# Altium project converter.PrjPcb (part 3 of 3)

## Sheet [04] - POWER SUPPLY.SchDoc
size A4; DocumentNumber: 3; SheetNumber: 3; SheetTotal: 6
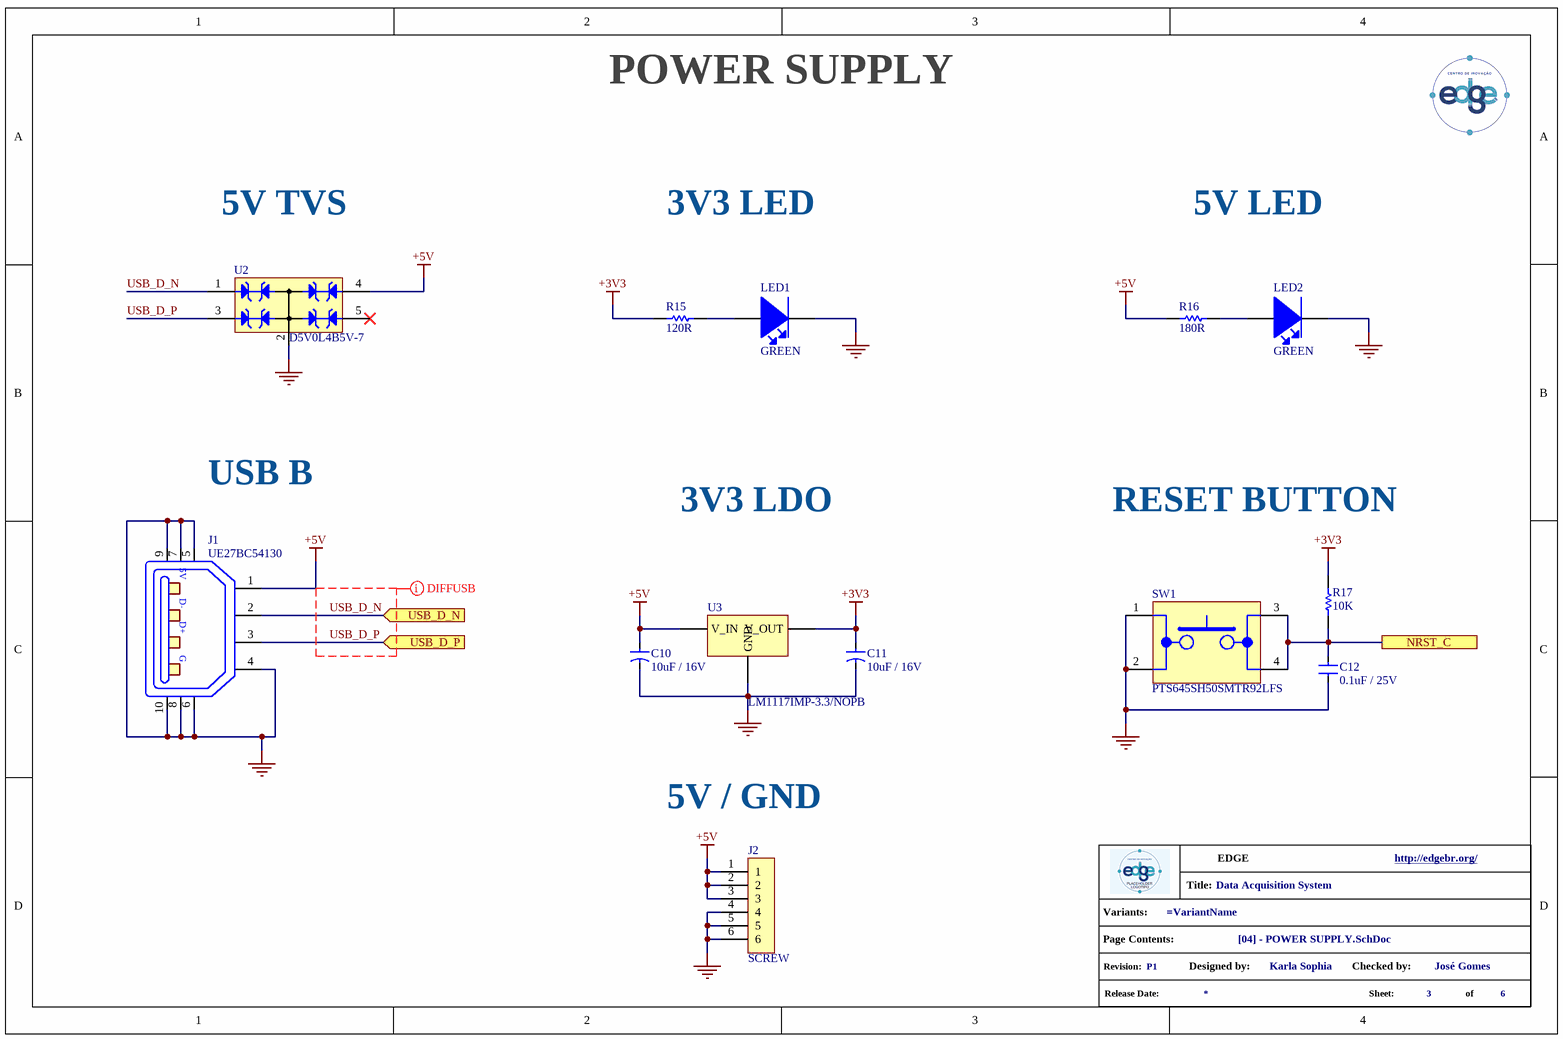
[diagram p5: [04] - POWER SUPPLY.SchDoc]

### Parts
(Parts that share a designator on the sheet are numbered #1, #2 ... from top to bottom, then left to right.)
*?#6  info_project  (value not drawn)  (graphical)
C10  10uF / 16V  [CT0805]
C11  10uF / 16V  [CT0805]
C12  0.1uF / 25V  [C0805]
J1  UE27BC54130  [UE27BC54130]
J2  SCREW  [SCREW-6P]
LED1  GREEN  [LED_0805]
LED2  GREEN  [LED_0805]
R15  120R  [R0805]
R16  180R  [R0805]
R17  10K  [R0805]
SW1  PTS645SH50SMTR92LFS  [PTS645SH50SMTR92-LFS]
U2  D5V0L4B5V-7  [D5V0L4B5V-7]
U3  LM1117IMP-3.3/NOPB  [LM1117]

### Ports
NRST_C, USB_D_N (in), USB_D_P (in)

### Nets
+3V3: C11.1 R15.1 R17.2 U3.2(V_OUT)
+5V: C10.1 J1.1 J2.1 J2.2 J2.3 R16.1 U2.4 U3.1(V_IN)
GND: C10.2 C11.2 C12.1 J1.4 J1.5 J1.6 J1.7 J1.8 J1.9 J1.10 J2.4 J2.5 J2.6 LED1.1(Cathode) LED2.1(Cathode) SW1.1 SW1.2 U2.2 U3.3(GND)
NRST_C: C12.2 R17.1 SW1.3 SW1.4 ; port NRST_C
USB_D_N: J1.2 U2.1 ; port USB_D_N
USB_D_P: J1.3 U2.3 ; port USB_D_P
NetLED1_2: LED1.2(Anode) R15.2
NetLED2_2: LED2.2(Anode) R16.2

Not connected (* = marked no-connect by the designer): U2 5*

### Layout directives
differential pair; net class USB; differential pair class USB_D_LINES: USB_D_N, USB_D_P

### Notes on the sheet
- POWER SUPPLY
- 5V TVS
- 3V3 LED
- 5V LED
- USB B
- 3V3 LDO
- RESET BUTTON
- 5V / GND
- (in symbol info_project) Title:; Variants:; Page Contents:; Revision:; Designed by:; Checked by:; Release Date:; Sheet:; of
- (in symbol UE27BC54130) 5V; D-; D+; G

### Library data of the parts
C10 C11 = TCTP1C106M8R: TAL CAP - 10UF 16V 0805 +/- 20%; Manufacturer: Rohm; ESR (Equivalent Series Resistance): 6R; Supplier 1: Digi-Key; Manufacturer Part Number: TCTP1C106M8R; RoHS: Yes; Category: Tantalum Capacitors; Stock 1: 134422; Pricing 1: 1=0,86000, 10=0,63300, 50=0,50640, 100=0,43400, 500=0,34360, 1000=0,28934 (USD); Mount: Surface Mount; Case/Package: 0805; Case Code (Metric): 2012; Case Code (Imperial): 0805; Min Operating Temperature: -55°C; Max Operating Temperature: 125°C; Package Quantity: 3000; Capacitance: 10uF; Voltage Rating: 16V; Tolerance: 20%; Packaging: Tape and Reel; Voltage: 16V; Features: General Purpose; Series: TCT; Length: 0.079inch; Width: 0.049inch; Height - Seated (Max): 0.047inch; Lead Free: Lead Free; RoHS Compliant: Yes; ComponentLink1URL: https://datasheet.ciiva.com/259/tct-p-259243.pdf?src-supplier=Digi-Key; ComponentLink1Description: https://datasheet.ciiva.com/259/tct-p-259243.pdf?src-supplier=Digi-Key; ComponentLink2URL: https://datasheet.ciiva.com/259/tct-p-259244.pdf?src-supplier=Digi-Key; ComponentLink2Description: https://datasheet.ciiva.com/259/tct-p-259244.pdf?src-supplier=Digi-Key; ComponentLink3URL: https://datasheet.ciiva.com/259/tct-p-259245.pdf?src-supplier=Digi-Key; ComponentLink3Description: https://datasheet.ciiva.com/259/tct-p-259245.pdf?src-supplier=Digi-Key; Supplier Part Number 1: 511-1683-1-ND
C12 = CC0805KRX7R8BB104: MLCC - 0.1uF 25V 0805 X7R +/- 10%; Manufacturer: Yageo; Material: Ceramic; Capacitance: 100nF; Insulation Resistance: 100GR; Supplier 1: Digi-Key; Manufacturer Part Number: CC0805KRX7R8BB104; RoHS: Yes; Category: Ceramic Capacitors; Stock 1: 331734; Pricing 1: 1=0,12000, 10=0,08800, 50=0,04980, 100=0,04130, 500=0,02894, 1000=0,02396 (USD); Mount: Surface Mount; Case/Package: 0805; Number of Pins: 2; Case Code (Metric): 2012; Case Code (Imperial): 0805; Min Operating Temperature: -55°C; Max Operating Temperature: 125°C; Tolerance: 10%; Dielectric: X7R; Series: CC; Package Quantity: 1; Voltage Rating: 25V; Packaging: Tape and Reel; Voltage Rating (DC): 25V; Termination: SMD/SMT; Resistor Type: Ceramic; Length: 2mm; Width: 0.049inch; Height: 0.85mm; Depth: 1.25mm; Thickness: 0.033inch; Radiation Hardening: No; RoHS Compliant: Yes; REACH SVHC: No SVHC; Lead Free: Lead Free; Halogen Free: Halogen Free; ComponentLink1URL: https://datasheet.ciiva.com/145/mlccorderingcode-145007.pdf?src-supplier=Digi-Key; ComponentLink1Description: https://datasheet.ciiva.com/145/mlccorderingcode-145007.pdf?src-supplier=Digi-Key; ComponentLink2URL: https://datasheet.ciiva.com/145/mlccorderingcode-145008.pdf?src-supplier=Digi-Key; ComponentLink2Description: https://datasheet.ciiva.com/145/mlccorderingcode-145008.pdf?src-supplier=Digi-Key; ComponentLink3URL: https://datasheet.ciiva.com/145/mlccorderingcode-145009.pdf?src-supplier=Digi-Key; ComponentLink3Description: https://datasheet.ciiva.com/145/mlccorderingcode-145009.pdf?src-supplier=Digi-Key; ComponentLink4URL: https://datasheet.ciiva.com/8034/1784427-8034029.pdf?src-supplier=Element14; ComponentLink4Description: https://datasheet.ciiva.com/8034/1784427-8034029.pdf?src-supplier=Element14; ComponentLink5URL: https://datasheet.ciiva.com/8034/1784427-8034030.pdf?src-supplier=Element14; ComponentLink5Description: https://datasheet.ciiva.com/8034/1784427-8034030.pdf?src-supplier=Element14; ComponentLink6URL: https://datasheet.ciiva.com/8034/70765-8034031.pdf?src-supplier=Element14; ComponentLink6Description: https://datasheet.ciiva.com/8034/70765-8034031.pdf?src-supplier=Element14; ComponentLink7URL: https://datasheet.ciiva.com/46430/1850775-46430166.pdf?src-supplier=Element14; ComponentLink7Description: https://datasheet.ciiva.com/46430/1850775-46430166.pdf?src-supplier=Element14; ComponentLink8URL: https://datasheet.ciiva.com/28450/1489800-28450789.pdf?src-supplier=Element14; ComponentLink8Description: https://datasheet.ciiva.com/28450/1489800-28450789.pdf?src-supplier=Element14; ComponentLink9URL: https://datasheet.ciiva.com/15189/getdatasheetpartid-330244-15189223.pdf?src-supplier=Verical; ComponentLink9Description: https://datasheet.ciiva.com/15189/getdatasheetpartid-330244-15189223.pdf?src-supplier=Verical; ComponentLink10URL: https://datasheet.ciiva.com/16625/upy-gphc-x7r-6-3v-to-50v-8-16625546.pdf?src-supplier=Avnet+Europe; ComponentLink10Description: https://datasheet.ciiva.com/16625/upy-gphc-x7r-6-3v-to-50v-8-16625546.pdf?src-supplier=Avnet+Europe; Supplier Part Number 1: 311-1141-1-ND
J1 = UE27BC54130: CONN USB RECPT B 2.0; Manufacturer: Amphenol Commercial; Number of Terminals/Pins: 4; Gender: Receptacle; Number of Ports: 1; Insulation Resistance: 1GR; Pitch: 2.5mm; Supplier 1: Digi-Key; Manufacturer Part Number: UE27BC54130; RoHS: Yes; Category: RF / Coaxial Connectors; Stock 1: 8145; Pricing 1: 1=1,15000, 10=1,01500, 25=0,95560, 40=0,91575, 120=0,87592, 240=0,79633, 480=0,71669, 960=0,63705, 2400=0,57733 (USD); Mount: Through Hole,Horizontal; Contact Plating: Gold; Color: Black; Contact Material: Bronze; Housing Material: Polybutylene; Termination: Solder; Packaging: Bulk; Connector Type: USB; Number of Contacts: 4; Orientation: Right Angle; Package Quantity: 3000; Series: UE27; Length: 12.04mm; Depth: 16.3mm; Radiation Hardening: No; ComponentLink1URL: https://datasheet.ciiva.com/851/ue27bcx4xxx-851809.pdf?src-supplier=Digi-Key; ComponentLink1Description: https://datasheet.ciiva.com/851/ue27bcx4xxx-851809.pdf?src-supplier=Digi-Key; ComponentLink2URL: https://datasheet.ciiva.com/10945/ue27bcx4xxx-10945210.pdf?src-supplier=Avnet; ComponentLink2Description: https://datasheet.ciiva.com/10945/ue27bcx4xxx-10945210.pdf?src-supplier=Avnet; ComponentLink3URL: https://datasheet.ciiva.com/16668/ue27bcx4xxx-16668218.pdf?src-supplier=Avnet+Europe; ComponentLink3Description: https://datasheet.ciiva.com/16668/ue27bcx4xxx-16668218.pdf?src-supplier=Avnet+Europe; Supplier Part Number 1: UE27BC54130-ND
J2 = 282834-6: TERM BLK 6P SIDE 2.54MM; Manufacturer: TE Connectivity; Plating: Brass,Steel; Number of Contacts: 6; Current Rating: 10A; Voltage Rating: 150V; Number of Levels: 1; Connector Type: Receptacle; Closed End: No (Without); Screwless Terminal Block: Yes (With); Gender: Female; Wire Gauge (Max): 30AWG; Wire Gauge (Min): 16AWG; Thread Size: M1.6; Tail Length: 3.4mm; Approvals: UL; Supplier 1: Digi-Key; Manufacturer Part Number: 282834-6; RoHS: Yes; Category: Terminal Blocks; Stock 1: 7269; Pricing 1: 1=5,33000, 10=4,06500, 25=3,80720, 50=3,38400, 100=3,31050, 250=3,05300, 500=2,75874, 1000=2,45221 (USD); Mount: Through Hole; Color: Green; Contact Plating: Tin; Contact Material: Brass; Housing Color: Green; Housing Material: Polyamide; Material: Nylon; Min Operating Temperature: -40°C; Max Operating Temperature: 105°C; Termination: Solder; Orientation: Straight; Package Quantity: 100; Packaging: Box; Number of Rows: 1; Series: Buchanan; Number of Positions Per Level: 6; Current: 10A; Voltage: 150V; Number of Positions: 6; Number of Circuits: 6; Max Current Rating: 10A; Interlock: No (Without); Screw Flange: No (Without); Side Stackable: Yes (With); Max Supply Voltage (AC): 150V; Number of Poles: 6; Max Voltage Rating (AC): 150V; Length: 15.7mm; Width: 6.5mm; Pitch: 2.54mm; Depth: 6.5mm; Wire/Cable Gauge: 30AWG; Radiation Hardening: No; Flammability Rating: UL94 V-0; ELV: Compliant; REACH SVHC: Unknown; Lead Free: Lead Free; ComponentLink1URL: https://datasheet.ciiva.com/823/eng-cd-282834-c1-823488.pdf?src-supplier=Digi-Key; ComponentLink1Description: https://datasheet.ciiva.com/823/eng-cd-282834-c1-823488.pdf?src-supplier=Digi-Key; ComponentLink2URL: https://datasheet.ciiva.com/16308/282834-6-16308413.pdf?src-supplier=Future+Electronics; ComponentLink2Description: https://datasheet.ciiva.com/16308/282834-6-16308413.pdf?src-supplier=Future+Electronics; ComponentLink3URL: https://datasheet.ciiva.com/25618/0900766b810c7187-25618156.pdf?src-supplier=RSComponents; ComponentLink3Description: https://datasheet.ciiva.com/25618/0900766b810c7187-25618156.pdf?src-supplier=RSComponents; ComponentLink4URL: https://datasheet.ciiva.com/9370/eng-cs-1308389-eurostyle-terminal-blocks-0607-9370422.pdf?src-supplier=Avnet; ComponentLink4Description: https://datasheet.ciiva.com/9370/eng-cs-1308389-eurostyle-terminal-blocks-0607-9370422.pdf?src-supplier=Avnet; ComponentLink5URL: https://datasheet.ciiva.com/16676/eng-cs-1308389-eurostyle-terminal-blocks-0607-16676062.pdf?src-supplier=Avnet+Europe; ComponentLink5Description: https://datasheet.ciiva.com/16676/eng-cs-1308389-eurostyle-terminal-blocks-0607-16676062.pdf?src-supplier=Avnet+Europe; ComponentLink6URL: https://datasheet.ciiva.com/30097/eng-cs-1308389-eurostyle-terminal-blocks-0607-30097352.pdf?src-supplier=Onlinecomponents.com; ComponentLink6Description: https://datasheet.ciiva.com/30097/eng-cs-1308389-eurostyle-terminal-blocks-0607-30097352.pdf?src-supplier=Onlinecomponents.com; Supplier Part Number 1: A98337-ND
LED1 = 7012X5: SMD LED GREEN 2.1V 0805 20mA; Manufacturer: VCC CHML; Lens Color: Clear; Lens Style: Diffused,Rectangular; Luminous Intensity: 6.4mcd; Viewing Angle: 120°; Wavelength: 560nm; Power Rating: 62.5mW; Number of Elements: 1; Reverse Voltage (DC): 4V; Supplier 1: Digi-Key; Manufacturer Part Number: 7012X5; RoHS: Yes; Category: LEDs; Stock 1: 153089; Pricing 1: 1=0,60000, 10=0,39600, 100=0,26210, 1000=0,20235, 2000=0,18285 (USD); Mount: Surface Mount; Case/Package: 0805; Number of Pins: 2; Color: Green; Case Code (Metric): 2012; Case Code (Imperial): 0805; Min Operating Temperature: -40°C; Max Operating Temperature: 85°C; Packaging: Tape and Reel; Forward Voltage: 2.1V; Package Quantity: 1; Illumination Color: Green; Forward Current: 20mA; Test Current: 20mA; Power Dissipation: 62.5mW; Reverse Voltage: 4V; Series: BrightChips™; Number of LEDs: 1; Length: 2mm; Width: 1.25mm; Height: 1mm; Depth: 1.25mm; Lead Free: Lead Free; RoHS Compliant: Yes; REACH SVHC: Unknown; ComponentLink1URL: https://datasheet.ciiva.com/2114/1-26-2114592.pdf?src-supplier=Digi-Key; ComponentLink1Description: https://datasheet.ciiva.com/2114/1-26-2114592.pdf?src-supplier=Digi-Key; ComponentLink2URL: https://datasheet.ciiva.com/7639/726505-7639302.pdf?src-supplier=Element14; ComponentLink2Description: https://datasheet.ciiva.com/7639/726505-7639302.pdf?src-supplier=Element14; ComponentLink3URL: https://datasheet.ciiva.com/46391/726505-46391115.pdf?src-supplier=Element14; ComponentLink3Description: https://datasheet.ciiva.com/46391/726505-46391115.pdf?src-supplier=Element14; ComponentLink4URL: https://datasheet.ciiva.com/16214/7012xseriesbrightchipshighbrightnesssmtleds0805packagesize-16214285.pdf?src-supplier=Future+Electronics; ComponentLink4Description: https://datasheet.ciiva.com/16214/7012xseriesbrightchipshighbrightnesssmtleds0805packagesize-16214285.pdf?src-supplier=Future+Electronics; Supplier Part Number 1: L61105CT-ND
LED2 = 150080GS75000: SMD LED GREEN 3.2V 0805 20mA; Manufacturer: Wurth Electronics; Viewing Angle: 140°; Lens Style: Clear,Rectangular; Luminous Intensity: 450mcd; Wavelength: 520nm; Forward Current: 30mA; Supplier 1: Digi-Key; Manufacturer Part Number: 150080GS75000; RoHS: Yes; Category: LEDs; Stock 1: 102669; Pricing 1: 1=0,18000, 50=0,16500, 100=0,14200, 500=0,12300 (USD); Mount: Surface Mount; Case/Package: 0805; Color: Green; Case Code (Metric): 2012; Case Code (Imperial): 0805; Min Operating Temperature: -40°C; Max Operating Temperature: 85°C; Package Quantity: 4000; Forward Voltage: 3.2V; Packaging: Cut Tape; Dominant Wavelength: 520nm; Test Current: 20mA; Length: 2mm; Width: 1.25mm; Height: 0.7mm; REACH SVHC: Unknown; RoHS Compliant: Yes; ComponentLink1URL: https://datasheet.ciiva.com/29563/150080gs75000-29563008.pdf?src-supplier=Digi-Key; ComponentLink1Description: https://datasheet.ciiva.com/29563/150080gs75000-29563008.pdf?src-supplier=Digi-Key; ComponentLink2URL: https://datasheet.ciiva.com/29279/759434-da-01-en-chipled-0805-w-kl-gruen-150080gs75000-29279039.pdf?src-supplier=Conrad; ComponentLink2Description: https://datasheet.ciiva.com/29279/759434-da-01-en-chipled-0805-w-kl-gruen-150080gs75000-29279039.pdf?src-supplier=Conrad; Supplier Part Number 1: 732-4983-1-ND
R15 = RMCF0805JT120R: RES - 120R 1/8W 0805 5%; Manufacturer: Stackpole Electronics; Max Power Dissipation: 125mW; Temperature Coefficient: 200ppm/°C; Supplier 1: Digi-Key; Manufacturer Part Number: RMCF0805JT120R; RoHS: Yes; Category: Chip SMD Resistors; Stock 1: 223393; Pricing 1: 1=0.10000, 10=0.02000, 100=0.00810, 1000=0.00366, 2500=0.00318 (USD); Mount: Surface Mount; Case/Package: 0805; Case Code (Metric): 2012; Case Code (Imperial): 0805; Contact Plating: Tin,Matte; Min Operating Temperature: -55°C; Max Operating Temperature: 155°C; Packaging: Tape and Reel; Resistance: 120R; Tolerance: 5%; Resistor Type: Thick Film; Number of Terminations: 2; Features: Automotive AEC-Q200; Series: RMCF; Construction: Rectangular; Length: 0.079inch; Width: 0.049inch; Height: 0.026inch; Depth: 1.25mm; Radiation Hardening: No; Military Standard: Not; Lead Free: Lead Free; RoHS Compliant: Yes; ComponentLink1URL: https://datasheet.ciiva.com/15193/getdatasheetpartid-409758-15193629.pdf?src-supplier=Verical; ComponentLink1Description: https://datasheet.ciiva.com/15193/getdatasheetpartid-409758-15193629.pdf?src-supplier=Verical; Supplier Part Number 1: RMCF0805JT120RCT-ND
R16 = ERJ-6GEYJ181V: RES - 180R 1/8W 0805 5%; Manufacturer: Panasonic; Temperature Coefficient: 200ppm/°C; Voltage Rating: 150V; Power Rating: 125mW; Supplier 1: Digi-Key; Manufacturer Part Number: ERJ-6GEYJ181V; RoHS: Yes; Category: Chip SMD Resistors; Stock 1: 83932; Pricing 1: 1=0,10000, 10=0,06800, 100=0,02780, 1000=0,01246, 2500=0,01082 (USD); Mount: Surface Mount; Case/Package: 0805; Contact Plating: Tin; Case Code (Metric): 2012; Case Code (Imperial): 0805; Weight: 0.000194oz; Min Operating Temperature: -55°C; Max Operating Temperature: 155°C; Tolerance: 5%; Resistance: 180R; Resistor Type: Thick Film; Packaging: Tape and Reel; Package Quantity: 1; Number of Terminations: 2; Termination: SMD/SMT; Max Power Dissipation: 125mW; Voltage Rating (DC): 150V; Features: Automotive AEC-Q200; Series: ERJ; Construction: Rectangular; Resistance Tolerance: 5%; Technology: THICK FILM; Length: 2mm; Width: 0.049inch; Height: 0.6mm; Depth: 1.25mm; Radiation Hardening: No; REACH SVHC: No SVHC; Military Standard: Not; Lead Free: Lead Free; RoHS Compliant: Yes; ComponentLink1URL: https://datasheet.ciiva.com/11821/0900766b80f806dd-11821549.pdf?src-supplier=RSComponents; ComponentLink1Description: https://datasheet.ciiva.com/11821/0900766b80f806dd-11821549.pdf?src-supplier=RSComponents; ComponentLink2URL: https://datasheet.ciiva.com/46386/1500035-46386364.pdf?src-supplier=Element14; ComponentLink2Description: https://datasheet.ciiva.com/46386/1500035-46386364.pdf?src-supplier=Element14; ComponentLink3URL: https://datasheet.ciiva.com/5860/1500035-5860701.pdf?src-supplier=Farnell; ComponentLink3Description: https://datasheet.ciiva.com/5860/1500035-5860701.pdf?src-supplier=Farnell; ComponentLink4URL: https://datasheet.ciiva.com/46373/1500035-46373964.pdf?src-supplier=Element14; ComponentLink4Description: https://datasheet.ciiva.com/46373/1500035-46373964.pdf?src-supplier=Element14; ComponentLink5URL: https://datasheet.ciiva.com/28546/1678796-28546149.pdf?src-supplier=Element14; ComponentLink5Description: https://datasheet.ciiva.com/28546/1678796-28546149.pdf?src-supplier=Element14; ComponentLink6URL: https://datasheet.ciiva.com/24124/aoa0000ce1-37422-24124213.pdf?src-supplier=Mouser; ComponentLink6Description: https://datasheet.ciiva.com/24124/aoa0000ce1-37422-24124213.pdf?src-supplier=Mouser; ComponentLink7URL: https://datasheet.ciiva.com/16787/70255313-16787531.pdf?src-supplier=Allied+Electronics; ComponentLink7Description: https://datasheet.ciiva.com/16787/70255313-16787531.pdf?src-supplier=Allied+Electronics; ComponentLink8URL: https://datasheet.ciiva.com/16782/70255313-16782252.pdf?src-supplier=Allied+Electronics; ComponentLink8Description: https://datasheet.ciiva.com/16782/70255313-16782252.pdf?src-supplier=Allied+Electronics; ComponentLink9URL: https://datasheet.ciiva.com/9184/aoa0000ce1-9184891.pdf?src-supplier=Avnet; ComponentLink9Description: https://datasheet.ciiva.com/9184/aoa0000ce1-9184891.pdf?src-supplier=Avnet; ComponentLink10URL: https://datasheet.ciiva.com/30073/4aoa0000ce1-30073221.pdf?src-supplier=Onlinecomponents.com; ComponentLink10Description: https://datasheet.ciiva.com/30073/4aoa0000ce1-30073221.pdf?src-supplier=Onlinecomponents.com; ComponentLink11URL: https://datasheet.ciiva.com/17207/aoa0000ce1-17207135.pdf?src-supplier=Avnet+Europe; ComponentLink11Description: https://datasheet.ciiva.com/17207/aoa0000ce1-17207135.pdf?src-supplier=Avnet+Europe; Supplier Part Number 1: P180ACT-ND
R17 = RC0805FR-0710KL: RES - 10K  1/8W 0805 1%; Manufacturer: Yageo; Resistance: 10kR; Temperature Coefficient: 100ppm/°C; Power Rating: 125mW; Voltage Rating: 150V; Supplier 1: Digi-Key; Manufacturer Part Number: RC0805FR-0710KL; RoHS: Yes; Category: Chip SMD Resistors; Stock 1: 5866675; Pricing 1: 1=0,10000, 10=0,04200, 100=0,01690, 1000=0,00759, 2500=0,00659 (USD); Case/Package: 0805; Case Code (Imperial): 0805; Case Code (Metric): 2012; Size Code: 0805; Min Operating Temperature: -55°C; Max Operating Temperature: 155°C; Tolerance: 1%; Resistor Type: Thick Film; Packaging: Tape and Reel; Package Quantity: 1; Termination: SMD/SMT; Number of Terminations: 2; Max Power Dissipation: 125mW; Features: Moisture Resistant; Series: RC; Construction: Rectangular; Resistance Tolerance: 1%; Technology: THICK FILM; Length: 2mm; Width: 0.049inch; Height: 0.024inch; Depth: 1.25mm; REACH SVHC: Unknown; Military Standard: Not; Lead Free: Lead Free; RoHS Compliant: Yes; ComponentLink1URL: https://datasheet.ciiva.com/11808/0900766b8106beab-11808151.pdf?src-supplier=RSComponents; ComponentLink1Description: https://datasheet.ciiva.com/11808/0900766b8106beab-11808151.pdf?src-supplier=RSComponents; ComponentLink2URL: https://datasheet.ciiva.com/12669/rc0805-12669688.pdf?src-supplier=Mouser; ComponentLink2Description: https://datasheet.ciiva.com/12669/rc0805-12669688.pdf?src-supplier=Mouser; ComponentLink3URL: https://datasheet.ciiva.com/2456/pyu-r-int-thick-7-2456974.pdf?src-supplier=Digi-Key; ComponentLink3Description: https://datasheet.ciiva.com/2456/pyu-r-int-thick-7-2456974.pdf?src-supplier=Digi-Key; ComponentLink4URL: https://datasheet.ciiva.com/2456/pyu-r-int-thick-7-2456972.pdf?src-supplier=Digi-Key; ComponentLink4Description: https://datasheet.ciiva.com/2456/pyu-r-int-thick-7-2456972.pdf?src-supplier=Digi-Key; ComponentLink5URL: https://datasheet.ciiva.com/2456/pyu-r-int-thick-7-2456973.pdf?src-supplier=Digi-Key; ComponentLink5Description: https://datasheet.ciiva.com/2456/pyu-r-int-thick-7-2456973.pdf?src-supplier=Digi-Key; ComponentLink6URL: https://datasheet.ciiva.com/16747/rc0805-16747087.pdf?src-supplier=Future+Electronics; ComponentLink6Description: https://datasheet.ciiva.com/16747/rc0805-16747087.pdf?src-supplier=Future+Electronics; ComponentLink7URL: https://datasheet.ciiva.com/46447/444164-46447563.pdf?src-supplier=Element14; ComponentLink7Description: https://datasheet.ciiva.com/46447/444164-46447563.pdf?src-supplier=Element14; Supplier Part Number 1: 311-10.0KCRCT-ND
SW1 = PTS645SH50SMTR92LFS: SWITCH TACTILE 0.05A 12V; Manufacturer: ITT C&K; Mechanical Life: 100000Cycles; Actuator Material: Nylon,Polyamide,PA66; Operating Force: 200gf; Throw Configuration: SPST; Current Rating: 50mA; Illumination Type: Non-Illuminated,Illuminated; Switch Function: Off-Mom; Actuator Type: Standard; Supplier 1: Digi-Key; Manufacturer Part Number: PTS645SH50SMTR92LFS; RoHS: Yes; Category: Tactile Switches; Stock 1: 211938; Pricing 1: 1=0,25000, 10=0,24200, 25=0,22960, 100=0,20780, 250=0,18944, 500=0,17610 (USD); Mount: Surface Mount; Case/Package: SMD/SMT; Contact Plating: Silver; Contact Material: Bronze; Color: Black; Min Operating Temperature: -20°C; Max Operating Temperature: 60°C; Packaging: Tape and Reel; Max Voltage Rating (DC): 12V; Termination: Gull Wing; Voltage Rating (DC): 12V; Package Quantity: 1000; Max Current Rating: 50mA; Orientation: Straight; Series: PTS645; Length: 6mm; Depth: 9mm; Lead Free: Lead Free; REACH SVHC: No SVHC; ComponentLink1URL: https://datasheet.ciiva.com/29903/getdatasheetpartid-773702-29903807.pdf?src-supplier=Verical; ComponentLink1Description: https://datasheet.ciiva.com/29903/getdatasheetpartid-773702-29903807.pdf?src-supplier=Verical; ComponentLink2URL: https://datasheet.ciiva.com/14920/pts645-14920741.pdf?src-supplier=Digi-Key; ComponentLink2Description: https://datasheet.ciiva.com/14920/pts645-14920741.pdf?src-supplier=Digi-Key; ComponentLink3URL: https://datasheet.ciiva.com/22637/1707731-22637356.pdf?src-supplier=Element14; ComponentLink3Description: https://datasheet.ciiva.com/22637/1707731-22637356.pdf?src-supplier=Element14; Supplier Part Number 1: CKN9085CT-ND
U2 = D5V0L4B5V-7: ESD TVS VRWM - 5V / VBR - 6-8V /; Manufacturer: Diodes; Direction: Bidirectional; Capacitance: 20pF; Max Surge Current: 6A; Number of Bidirectional Channels: 4; Min Breakdown Voltage: 6V; Clamping Voltage: 14V; Peak Pulse Power: 84W; Power Line Protection: No; Breakdown Voltage: 7V; Max Power Dissipation: 380mW; ESD Protection: Yes; Max Reverse Leakage Current: 100nA; Test Current: 1mA; Diode Type: ZENER; Supplier 1: Digi-Key; Manufacturer Part Number: D5V0L4B5V-7; RoHS: Yes; Category: TVS Diodes; Stock 1: 22216; Pricing 1: 1=0,51000, 10=0,38600, 100=0,24040, 500=0,16444, 1000=0,12650 (USD); Mount: Surface Mount; Case/Package: SOT-553; Number of Pins: 5; Contact Plating: Tin,Matte; Min Operating Temperature: -65°C; Max Operating Temperature: 150°C; Package Quantity: 3000; Packaging: Tape and Reel; Reverse Standoff Voltage: 5V; Number of Channels: 4; Polarity: Bidirectional; Termination: SMD/SMT; Working Voltage: 5V; Leakage Current: 100nA; Peak Pulse Current: 6A; Resistor Type: Zener; Series: -; Length: 1.6mm; Width: 1.25mm; Height: 0.6mm; Depth: 1.2mm; Radiation Hardening: No; Lead Free: Lead Free; REACH SVHC: No SVHC; RoHS Compliant: Yes; ComponentLink1URL: https://datasheet.ciiva.com/12326/d5v0l4b5v-218334-12326570.pdf?src-supplier=Mouser; ComponentLink1Description: https://datasheet.ciiva.com/12326/d5v0l4b5v-218334-12326570.pdf?src-supplier=Mouser; ComponentLink2URL: https://datasheet.ciiva.com/334/d5v0l4b5v-334001.pdf?src-supplier=Digi-Key; ComponentLink2Description: https://datasheet.ciiva.com/334/d5v0l4b5v-334001.pdf?src-supplier=Digi-Key; ComponentLink3URL: https://datasheet.ciiva.com/25624/0900766b8115c347-25624818.pdf?src-supplier=RSComponents; ComponentLink3Description: https://datasheet.ciiva.com/25624/0900766b8115c347-25624818.pdf?src-supplier=RSComponents; ComponentLink4URL: https://datasheet.ciiva.com/11193/d5v0l4b5v-11193845.pdf?src-supplier=Avnet; ComponentLink4Description: https://datasheet.ciiva.com/11193/d5v0l4b5v-11193845.pdf?src-supplier=Avnet; Supplier Part Number 1: D5V0L4B5V-7DICT-ND
U3 = LM1117IMP-3.3/NOPB: IC REG LDO 3.3V 800mA SOT223; Manufacturer: Texas Instruments; Number of Outputs: 1; Max Input Voltage: 15V; Polarity: Positive; Quiescent Current: 15mA; Accuracy: 1%; Output Type: Fixed; Dropout Voltage: 1.2V; Min Input Voltage: 2.6V; Max Supply Voltage: 10V; Min Supply Voltage: 4.75V; Current Rating: 800A; Supplier 1: Mouser; Manufacturer Part Number: LM1117IMP-3.3/NOPB; RoHS: Yes; Category: Voltage Regulators - Linear; Stock 1: 5; Pricing 1: 1=1,28000, 10=1,15000, 50=1,09000, 100=0,89500, 1000=0,58300, 10000=0,58300 (USD); Mount: Surface Mount; Case/Package: SOT-223; Number of Pins: 4; Min Operating Temperature: -40°C; Max Operating Temperature: 125°C; Output Voltage: 3.3V; Max Output Current: 800mA; Packaging: Tape and Reel; Output Current: 800mA; Nominal Output Voltage: 3.3V; Termination: SMD/SMT; Output Voltage Accuracy: 1%; Number of Regulators: 1; Min Current Limit: 800mA; Package Quantity: 1000; Length: 6.5mm; Width: 3.56mm; Height: 1.6mm; Radiation Hardening: No; REACH SVHC: No SVHC; Lead Free: Lead Free; RoHS Compliant: Yes; ComponentLink1URL: https://datasheet.ciiva.com/27051/1281318-27051810.pdf?src-supplier=Jameco; ComponentLink1Description: https://datasheet.ciiva.com/27051/1281318-27051810.pdf?src-supplier=Jameco; ComponentLink2URL: https://datasheet.ciiva.com/8042/1670636-8042261.pdf?src-supplier=Element14; ComponentLink2Description: https://datasheet.ciiva.com/8042/1670636-8042261.pdf?src-supplier=Element14; ComponentLink3URL: https://datasheet.ciiva.com/1570/1849796-1570171.pdf?src-supplier=Farnell; ComponentLink3Description: https://datasheet.ciiva.com/1570/1849796-1570171.pdf?src-supplier=Farnell; ComponentLink4URL: https://datasheet.ciiva.com/14149/lm1117-eng-tds-14149980.pdf?src-supplier=Distrelec; ComponentLink4Description: https://datasheet.ciiva.com/14149/lm1117-eng-tds-14149980.pdf?src-supplier=Distrelec; ComponentLink5URL: https://datasheet.ciiva.com/46386/1882372-46386042.pdf?src-supplier=Element14; ComponentLink5Description: https://datasheet.ciiva.com/46386/1882372-46386042.pdf?src-supplier=Element14; ComponentLink6URL: https://datasheet.ciiva.com/3223/lm1117-n-3223515.pdf?src-supplier=Avnet; ComponentLink6Description: https://datasheet.ciiva.com/3223/lm1117-n-3223515.pdf?src-supplier=Avnet; ComponentLink7URL: https://datasheet.ciiva.com/6580/lm1117-n-6580030.pdf?src-supplier=Digi-Key; ComponentLink7Description: https://datasheet.ciiva.com/6580/lm1117-n-6580030.pdf?src-supplier=Digi-Key; ComponentLink8URL: https://datasheet.ciiva.com/6580/lm1117-n-6580026.pdf?src-supplier=Digi-Key; ComponentLink8Description: https://datasheet.ciiva.com/6580/lm1117-n-6580026.pdf?src-supplier=Digi-Key; Supplier Part Number 1: 926-LM1117IMP3.3NOPB

## Sheet [05] - PERIPHERALS.SchDoc
size A4; DocumentNumber: 3; SheetNumber: 3; SheetTotal: 6
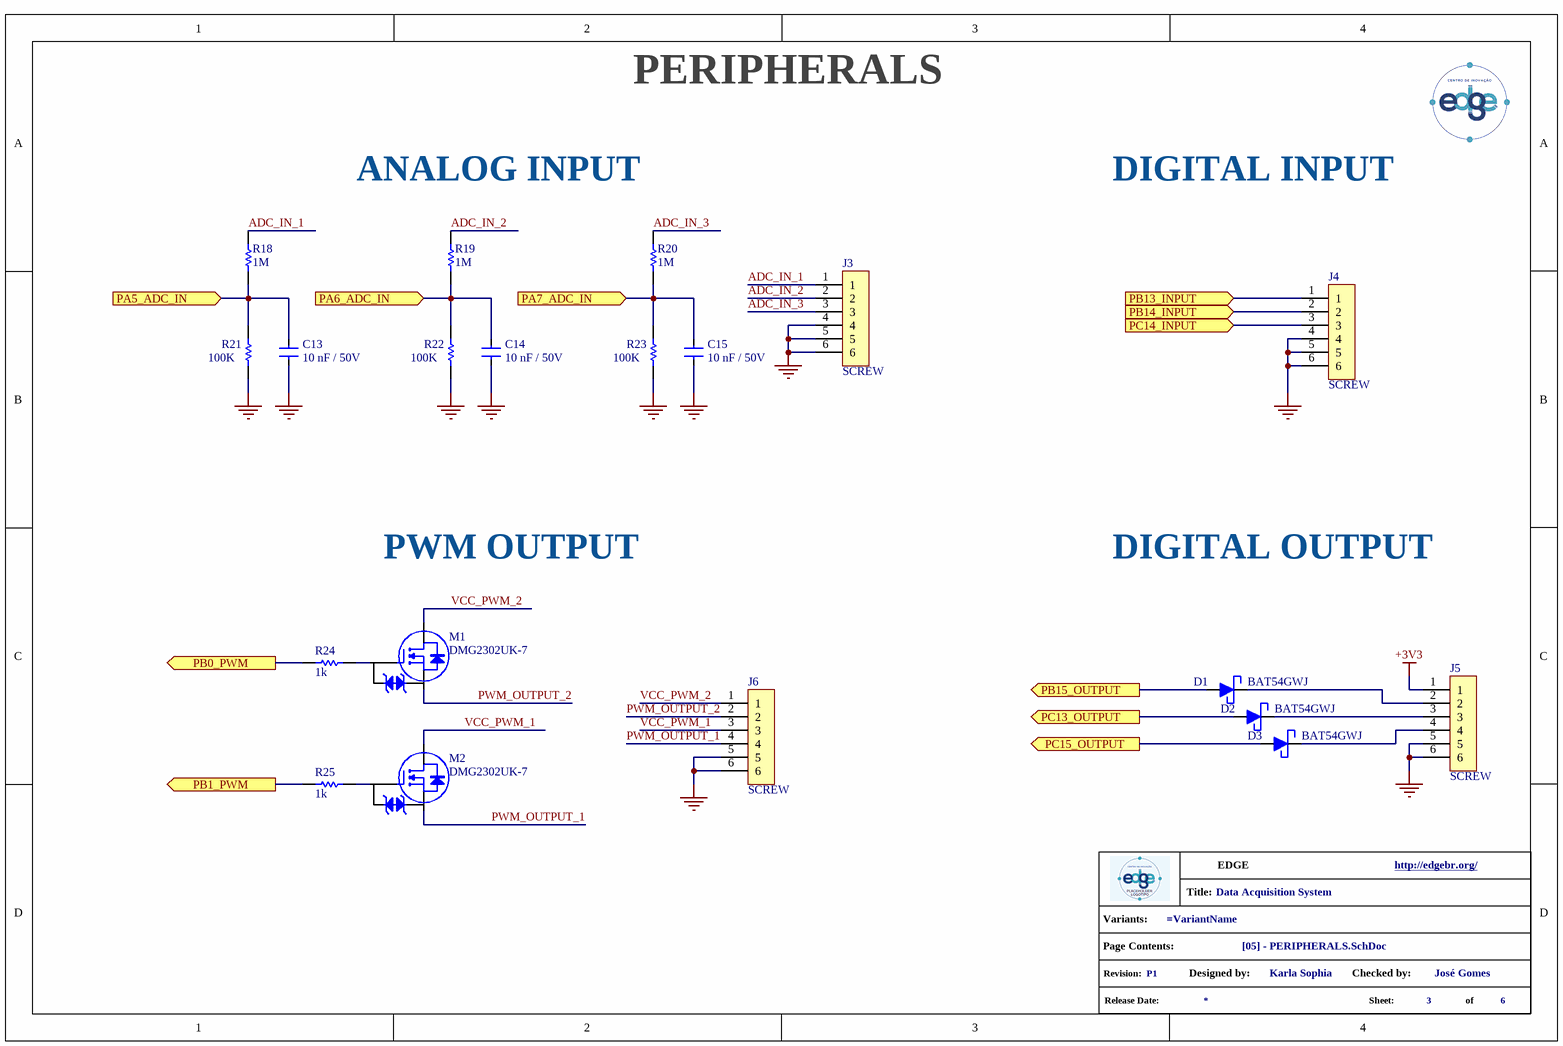
[diagram p6: [05] - PERIPHERALS.SchDoc]

### Parts
(Parts that share a designator on the sheet are numbered #1, #2 ... from top to bottom, then left to right.)
*?#7  info_project  (value not drawn)  (graphical)
C13  10 nF / 50V  [C0805]
C14  10 nF / 50V  [C0805]
C15  10 nF / 50V  [C0805]
D1  BAT54GWJ  [SOD123]
D2  BAT54GWJ  [SOD123]
D3  BAT54GWJ  [SOD123]
J3  SCREW  [SCREW-6P]
J4  SCREW  [SCREW-6P]
J5  SCREW  [SCREW-6P]
J6  SCREW  [SCREW-6P]
M1  DMG2302UK-7  [SOT23]
M2  DMG2302UK-7  [SOT23]
R18  1M  [R0805]
R19  1M  [R0805]
R20  1M  [R0805]
R21  100K  [R0805]
R22  100K  [R0805]
R23  100K  [R0805]
R24  1k  [R0805]
R25  1k  [R0805]

### Ports
PA5_ADC_IN (in), PA6_ADC_IN (in), PA7_ADC_IN (in), PB0_PWM (out), PB1_PWM (out), PB13_INPUT (in), PB14_INPUT (in), PB15_OUTPUT (out), PC13_OUTPUT (out), PC14_INPUT (in), PC15_OUTPUT (out)

### Nets
+3V3: J5.1
GND: C13.1 C14.1 C15.1 J3.4 J3.5 J3.6 J4.4 J4.5 J4.6 J5.5 J5.6 J6.5 J6.6 R21.1 R22.1 R23.1
ADC_IN_1: J3.1 R18.2
ADC_IN_2: J3.2 R19.2
ADC_IN_3: J3.3 R20.2
PA5_ADC_IN: C13.2 R18.1 R21.2 ; port PA5_ADC_IN
PA6_ADC_IN: C14.2 R19.1 R22.2 ; port PA6_ADC_IN
PA7_ADC_IN: C15.2 R20.1 R23.2 ; port PA7_ADC_IN
PB0_PWM: R24.1 ; port PB0_PWM
PB1_PWM: R25.1 ; port PB1_PWM
PB13_INPUT: J4.1 ; port PB13_INPUT
PB14_INPUT: J4.2 ; port PB14_INPUT
PB15_OUTPUT: D1.2 ; port PB15_OUTPUT
PC13_OUTPUT: D2.2 ; port PC13_OUTPUT
PC14_INPUT: J4.3 ; port PC14_INPUT
PC15_OUTPUT: D3.2 ; port PC15_OUTPUT
PWM_OUTPUT_1: J6.4 M2.2(S)
PWM_OUTPUT_2: J6.2 M1.2(S)
VCC_PWM_1: J6.3 M2.3(D)
VCC_PWM_2: J6.1 M1.3(D)
NetD1_1: D1.1 J5.2
NetD2_1: D2.1 J5.3
NetD3_1: D3.1 J5.4
NetM1_1: M1.1(G) R24.2
NetM2_1: M2.1(G) R25.2

### Notes on the sheet
- PERIPHERALS
- ANALOG INPUT
- DIGITAL INPUT
- PWM OUTPUT
- DIGITAL OUTPUT
- (in symbol info_project) Title:; Variants:; Page Contents:; Revision:; Designed by:; Checked by:; Release Date:; Sheet:; of

### Library data of the parts
C13-C15 = C0805C103J5GEC7800: MLCC - 10nF 50V 0805 C0G +/- 5%; Manufacturer: KEMET; Supplier 1: Digi-Key; Manufacturer Part Number: C0805C103J5GEC7800; RoHS: No; Stock 1: 1119; Pricing 1: 1=0.31000, 10=0.21500, 50=0.14300, 100=0.12160, 500=0.08584, 1000=0.07511 (USD); Supplier Part Number 1: 399-C0805C103J5GEC7800CT-ND
D1-D3 = BAT54GWJ: DIODE SCHOTTKY 30 V - 200 mA SOD123; Manufacturer: Nexperia USA; Max Reverse Voltage (DC): 30V; Average Rectified Current: 200mA; Supplier 1: Newark; Manufacturer Part Number: BAT54GWJ; RoHS: No; Mount: Surface Mount; Min Operating Temperature: -40°C; Max Operating Temperature: 85°C; Packaging: Cut Tape; ComponentLink1URL: https://assets.nexperia.com/documents/data-sheet/BAT54GW.pdf?src-supplier=Digi-Key; ComponentLink1Description: https://assets.nexperia.com/documents/data-sheet/BAT54GW.pdf?src-supplier=Digi-Key; Supplier Part Number 1: 73AH9681
J3-J6 = 282834-6: as J2 on sheet [04] - POWER SUPPLY; Supplier 1: Digi-Key; Manufacturer Part Number: 282834-6; RoHS: Yes; Category: Terminal Blocks; Stock 1: 7269; Pricing 1: 1=5,33000, 10=4,06500, 25=3,80720, 50=3,38400, 100=3,31050, 250=3,05300, 500=2,75874, 1000=2,45221 (USD); Mount: Through Hole; Color: Green; Contact Plating: Tin; Contact Material: Brass; Housing Color: Green; Housing Material: Polyamide; Material: Nylon; Min Operating Temperature: -40°C; Max Operating Temperature: 105°C; Termination: Solder; Orientation: Straight; Package Quantity: 100; Packaging: Box; Number of Rows: 1; Series: Buchanan; Number of Positions Per Level: 6; Current: 10A; Voltage: 150V; Number of Positions: 6; Number of Circuits: 6; Max Current Rating: 10A; Interlock: No (Without); Screw Flange: No (Without); Side Stackable: Yes (With); Max Supply Voltage (AC): 150V; Number of Poles: 6; Max Voltage Rating (AC): 150V; Length: 15.7mm; Width: 6.5mm; Pitch: 2.54mm; Depth: 6.5mm; Wire/Cable Gauge: 30AWG; Radiation Hardening: No; Flammability Rating: UL94 V-0; ELV: Compliant; REACH SVHC: Unknown; Lead Free: Lead Free; ComponentLink1URL: https://datasheet.ciiva.com/823/eng-cd-282834-c1-823488.pdf?src-supplier=Digi-Key; ComponentLink1Description: https://datasheet.ciiva.com/823/eng-cd-282834-c1-823488.pdf?src-supplier=Digi-Key; ComponentLink2URL: https://datasheet.ciiva.com/16308/282834-6-16308413.pdf?src-supplier=Future+Electronics; ComponentLink2Description: https://datasheet.ciiva.com/16308/282834-6-16308413.pdf?src-supplier=Future+Electronics; ComponentLink3URL: https://datasheet.ciiva.com/25618/0900766b810c7187-25618156.pdf?src-supplier=RSComponents; ComponentLink3Description: https://datasheet.ciiva.com/25618/0900766b810c7187-25618156.pdf?src-supplier=RSComponents; ComponentLink4URL: https://datasheet.ciiva.com/9370/eng-cs-1308389-eurostyle-terminal-blocks-0607-9370422.pdf?src-supplier=Avnet; ComponentLink4Description: https://datasheet.ciiva.com/9370/eng-cs-1308389-eurostyle-terminal-blocks-0607-9370422.pdf?src-supplier=Avnet; ComponentLink5URL: https://datasheet.ciiva.com/16676/eng-cs-1308389-eurostyle-terminal-blocks-0607-16676062.pdf?src-supplier=Avnet+Europe; ComponentLink5Description: https://datasheet.ciiva.com/16676/eng-cs-1308389-eurostyle-terminal-blocks-0607-16676062.pdf?src-supplier=Avnet+Europe; ComponentLink6URL: https://datasheet.ciiva.com/30097/eng-cs-1308389-eurostyle-terminal-blocks-0607-30097352.pdf?src-supplier=Onlinecomponents.com; ComponentLink6Description: https://datasheet.ciiva.com/30097/eng-cs-1308389-eurostyle-terminal-blocks-0607-30097352.pdf?src-supplier=Onlinecomponents.com; Supplier Part Number 1: A98337-ND
M1 M2 = DMG2302UK-7: MOSFET N-CHANNEL 20 V, 2.8 A, 0.061 OHM, SOT-23; Manufacturer: Diodes; Drain to Source Voltage (Vdss): 20V; Continuous Drain Current (ID): 2.8A; Rds On Max: 90mR; Input Capacitance: 130pF; Max Power Dissipation: 660mW; Supplier 1: Digi-Key; Manufacturer Part Number: DMG2302UK-7; RoHS: Yes; Category: MOSFETs; Stock 1: 678413; Pricing 1: 1=0,37000, 10=0,27900, 100=0,15800, 500=0,10460, 1000=0,08020 (USD); Mount: Surface Mount; Case/Package: TO-236-3; Min Operating Temperature: -55°C; Max Operating Temperature: 150°C; Packaging: Tape and Reel; RoHS Compliant: Yes; ComponentLink1URL: http://www.farnell.com/datasheets/2814387.pdf?src-supplier=Farnell; ComponentLink1Description: http://www.farnell.com/datasheets/2814387.pdf?src-supplier=Farnell; ComponentLink2URL: https://www.diodes.com/assets/Datasheets/DMG2302UK.pdf?src-supplier=Digi-Key; ComponentLink2Description: https://www.diodes.com/assets/Datasheets/DMG2302UK.pdf?src-supplier=Digi-Key; ComponentLink3URL: http://www.farnell.com/datasheets/2814387.pdf?src-supplier=Element14; ComponentLink3Description: http://www.farnell.com/datasheets/2814387.pdf?src-supplier=Element14; ComponentLink4URL: http://www.farnell.com/datasheets/2814387.pdf?src-supplier=Newark; ComponentLink4Description: http://www.farnell.com/datasheets/2814387.pdf?src-supplier=Newark; Supplier Part Number 1: DMG2302UK-7DICT-ND
R18-R20 = RMCF0805FT1M00: RES - 1M 1/8W 0805 1%; Manufacturer: Stackpole Electronics; Resistance: 1MR; Power Rating: 125mW; Temperature Coefficient: 100ppm/°C; Supplier 1: Digi-Key; Manufacturer Part Number: RMCF0805FT1M00; RoHS: Yes; Category: Chip SMD Resistors; Stock 1: 412220; Pricing 1: 1=0,10000, 10=0,02700, 100=0,01090, 1000=0,00488, 2500=0,00423 (USD); Mount: Surface Mount; Case/Package: 0805; Case Code (Metric): 2012; Case Code (Imperial): 0805; Contact Plating: Tin,Matte; Size Code: 0805; Min Operating Temperature: -55°C; Max Operating Temperature: 155°C; Tolerance: 1%; Packaging: Tape and Reel; Resistor Type: Thick Film; Number of Terminations: 2; Max Power Dissipation: 125mW; Features: Automotive AEC-Q200; Series: RMCF; Construction: Rectangular; Length: 2mm; Width: 0.049inch; Height: 0.026inch; Depth: 1.25mm; Radiation Hardening: No; Military Standard: Not; Lead Free: Lead Free; RoHS Compliant: Yes; ComponentLink1URL: http://components.arrow.com/part/dataview/50575311S7171767N1174?src-supplier=Arrow+Electronics; ComponentLink1Description: http://components.arrow.com/part/dataview/50575311S7171767N1174?src-supplier=Arrow+Electronics; ComponentLink2URL: https://www.seielect.com/catalog/SEI-Packaging.pdf?src-supplier=Digi-Key; ComponentLink2Description: https://www.seielect.com/catalog/SEI-Packaging.pdf?src-supplier=Digi-Key; ComponentLink3URL: http://www.seielect.com/Catalog/SEI-rmc.pdf?src-supplier=Future+Electronics; ComponentLink3Description: http://www.seielect.com/Catalog/SEI-rmc.pdf?src-supplier=Future+Electronics; ComponentLink4URL: https://www.seielect.com/catalog/SEI-RMCF_RMCP.pdf?src-supplier=Avnet; ComponentLink4Description: https://www.seielect.com/catalog/SEI-RMCF_RMCP.pdf?src-supplier=Avnet; ComponentLink5URL: https://www.verical.com/server-webapp/html/getDatasheet?partID=366460&src-supplier=Verical; ComponentLink5Description: https://www.verical.com/server-webapp/html/getDatasheet?partID=366460&src-supplier=Verical; Supplier Part Number 1: RMCF0805FT1M00CT-ND
R21-R23 = RC0805FR-07100KL: RES - 100K 1/8W 0805 1%; Manufacturer: Yageo; Resistance: 100kR; Temperature Coefficient: 100ppm/°C; Power Rating: 125mW; Voltage Rating (DC): 150V; Supplier 1: Digi-Key; Manufacturer Part Number: RC0805FR-07100KL; RoHS: Yes; Category: Chip SMD Resistors; Stock 1: 650822; Pricing 1: 1=0,10000, 10=0,04200, 100=0,01690, 1000=0,00759, 2500=0,00659 (USD); Case/Package: 0805; Number of Pins: 2; Case Code (Metric): 2012; Case Code (Imperial): 0805; Size Code: 0805; Min Operating Temperature: -55°C; Max Operating Temperature: 155°C; Resistor Type: Thick Film; Tolerance: 1%; Packaging: Tape and Reel; Voltage Rating: 150V; Package Quantity: 1; Number of Terminations: 2; Termination: SMD/SMT; Max Power Dissipation: 125mW; Features: Moisture Resistant; Series: RC; Construction: Rectangular; Resistance Tolerance: 1%; Technology: THICK FILM; Length: 2mm; Width: 0.049inch; Height: 0.024inch; Depth: 1.25mm; Lead Pitch: 0.4mm; REACH SVHC: Unknown; Lead Free: Lead Free; RoHS Compliant: Yes; Military Standard: Not; ComponentLink1URL: https://datasheet.ciiva.com/11808/0900766b8106beab-11808858.pdf?src-supplier=RSComponents; ComponentLink1Description: https://datasheet.ciiva.com/11808/0900766b8106beab-11808858.pdf?src-supplier=RSComponents; ComponentLink2URL: https://datasheet.ciiva.com/7941/1686128-7941677.pdf?src-supplier=Element14; ComponentLink2Description: https://datasheet.ciiva.com/7941/1686128-7941677.pdf?src-supplier=Element14; ComponentLink3URL: https://datasheet.ciiva.com/7660/38627-7660796.pdf?src-supplier=Element14; ComponentLink3Description: https://datasheet.ciiva.com/7660/38627-7660796.pdf?src-supplier=Element14; ComponentLink4URL: https://datasheet.ciiva.com/22747/444164-22747534.pdf?src-supplier=Element14; ComponentLink4Description: https://datasheet.ciiva.com/22747/444164-22747534.pdf?src-supplier=Element14; ComponentLink5URL: https://datasheet.ciiva.com/2457/pyu-r-int-thick-7-2457018.pdf?src-supplier=Digi-Key; ComponentLink5Description: https://datasheet.ciiva.com/2457/pyu-r-int-thick-7-2457018.pdf?src-supplier=Digi-Key; ComponentLink6URL: https://datasheet.ciiva.com/2457/pyu-r-int-thick-7-2457019.pdf?src-supplier=Digi-Key; ComponentLink6Description: https://datasheet.ciiva.com/2457/pyu-r-int-thick-7-2457019.pdf?src-supplier=Digi-Key; ComponentLink7URL: https://datasheet.ciiva.com/2457/pyu-r-int-thick-7-2457017.pdf?src-supplier=Digi-Key; ComponentLink7Description: https://datasheet.ciiva.com/2457/pyu-r-int-thick-7-2457017.pdf?src-supplier=Digi-Key; ComponentLink8URL: https://datasheet.ciiva.com/12667/rc0805-12667001.pdf?src-supplier=Mouser; ComponentLink8Description: https://datasheet.ciiva.com/12667/rc0805-12667001.pdf?src-supplier=Mouser; ComponentLink9URL: https://datasheet.ciiva.com/7941/1697719-7941676.pdf?src-supplier=Element14; ComponentLink9Description: https://datasheet.ciiva.com/7941/1697719-7941676.pdf?src-supplier=Element14; ComponentLink10URL: https://datasheet.ciiva.com/7941/1697719-7941678.pdf?src-supplier=Element14; ComponentLink10Description: https://datasheet.ciiva.com/7941/1697719-7941678.pdf?src-supplier=Element14; ComponentLink11URL: https://datasheet.ciiva.com/16747/rc0805-16747226.pdf?src-supplier=Future+Electronics; ComponentLink11Description: https://datasheet.ciiva.com/16747/rc0805-16747226.pdf?src-supplier=Future+Electronics; Supplier Part Number 1: 311-100KCRCT-ND
R24 R25 = RC0805FR-071KL: RES - 1K 1/8W 0805 1%; Manufacturer: Yageo; Resistance: 1kR; Temperature Coefficient: 100ppm/°C; Voltage Rating (DC): 150V; Power Rating: 125mW; Supplier 1: Digi-Key; Manufacturer Part Number: RC0805FR-071KL; RoHS: Yes; Category: Chip SMD Resistors; Stock 1: 7991149; Pricing 1: 1=0,10000, 10=0,04200, 100=0,01690, 1000=0,00759, 2500=0,00659 (USD); Case/Package: 0805; Number of Pins: 2; Case Code (Metric): 2012; Case Code (Imperial): 0805; Size Code: 0805; Min Operating Temperature: -55°C; Max Operating Temperature: 155°C; Tolerance: 1%; Resistor Type: Thick Film; Packaging: Tape and Reel; Package Quantity: 1; Voltage Rating: 150V; Number of Terminations: 2; Termination: SMD/SMT; Max Power Dissipation: 125mW; Features: Moisture Resistant; Series: RC; Resistance Tolerance: 1%; Construction: Rectangular; Length: 0.079inch; Width: 0.049inch; Height: 0.024inch; Depth: 1.25mm; REACH SVHC: Unknown; Lead Free: Lead Free; RoHS Compliant: Yes; Military Standard: Not; ComponentLink1URL: https://datasheet.ciiva.com/46385/444164-46385020.pdf?src-supplier=Element14; ComponentLink1Description: https://datasheet.ciiva.com/46385/444164-46385020.pdf?src-supplier=Element14; ComponentLink2URL: https://datasheet.ciiva.com/2456/pyu-r-int-thick-7-2456975.pdf?src-supplier=Digi-Key; ComponentLink2Description: https://datasheet.ciiva.com/2456/pyu-r-int-thick-7-2456975.pdf?src-supplier=Digi-Key; ComponentLink3URL: https://datasheet.ciiva.com/2456/pyu-r-int-thick-7-2456976.pdf?src-supplier=Digi-Key; ComponentLink3Description: https://datasheet.ciiva.com/2456/pyu-r-int-thick-7-2456976.pdf?src-supplier=Digi-Key; ComponentLink4URL: https://datasheet.ciiva.com/2456/pyu-r-int-thick-7-2456977.pdf?src-supplier=Digi-Key; ComponentLink4Description: https://datasheet.ciiva.com/2456/pyu-r-int-thick-7-2456977.pdf?src-supplier=Digi-Key; ComponentLink5URL: https://datasheet.ciiva.com/16850/rc0805-16850409.pdf?src-supplier=Future+Electronics; ComponentLink5Description: https://datasheet.ciiva.com/16850/rc0805-16850409.pdf?src-supplier=Future+Electronics; ComponentLink6URL: https://datasheet.ciiva.com/7941/1686128-7941719.pdf?src-supplier=Element14; ComponentLink6Description: https://datasheet.ciiva.com/7941/1686128-7941719.pdf?src-supplier=Element14; Supplier Part Number 1: 311-1.00KCRCT-ND

## Sheet [07] - REVISION HISTORY.SchDoc
size A3; DocumentNumber: 4; SheetNumber: 4; SheetTotal: 5
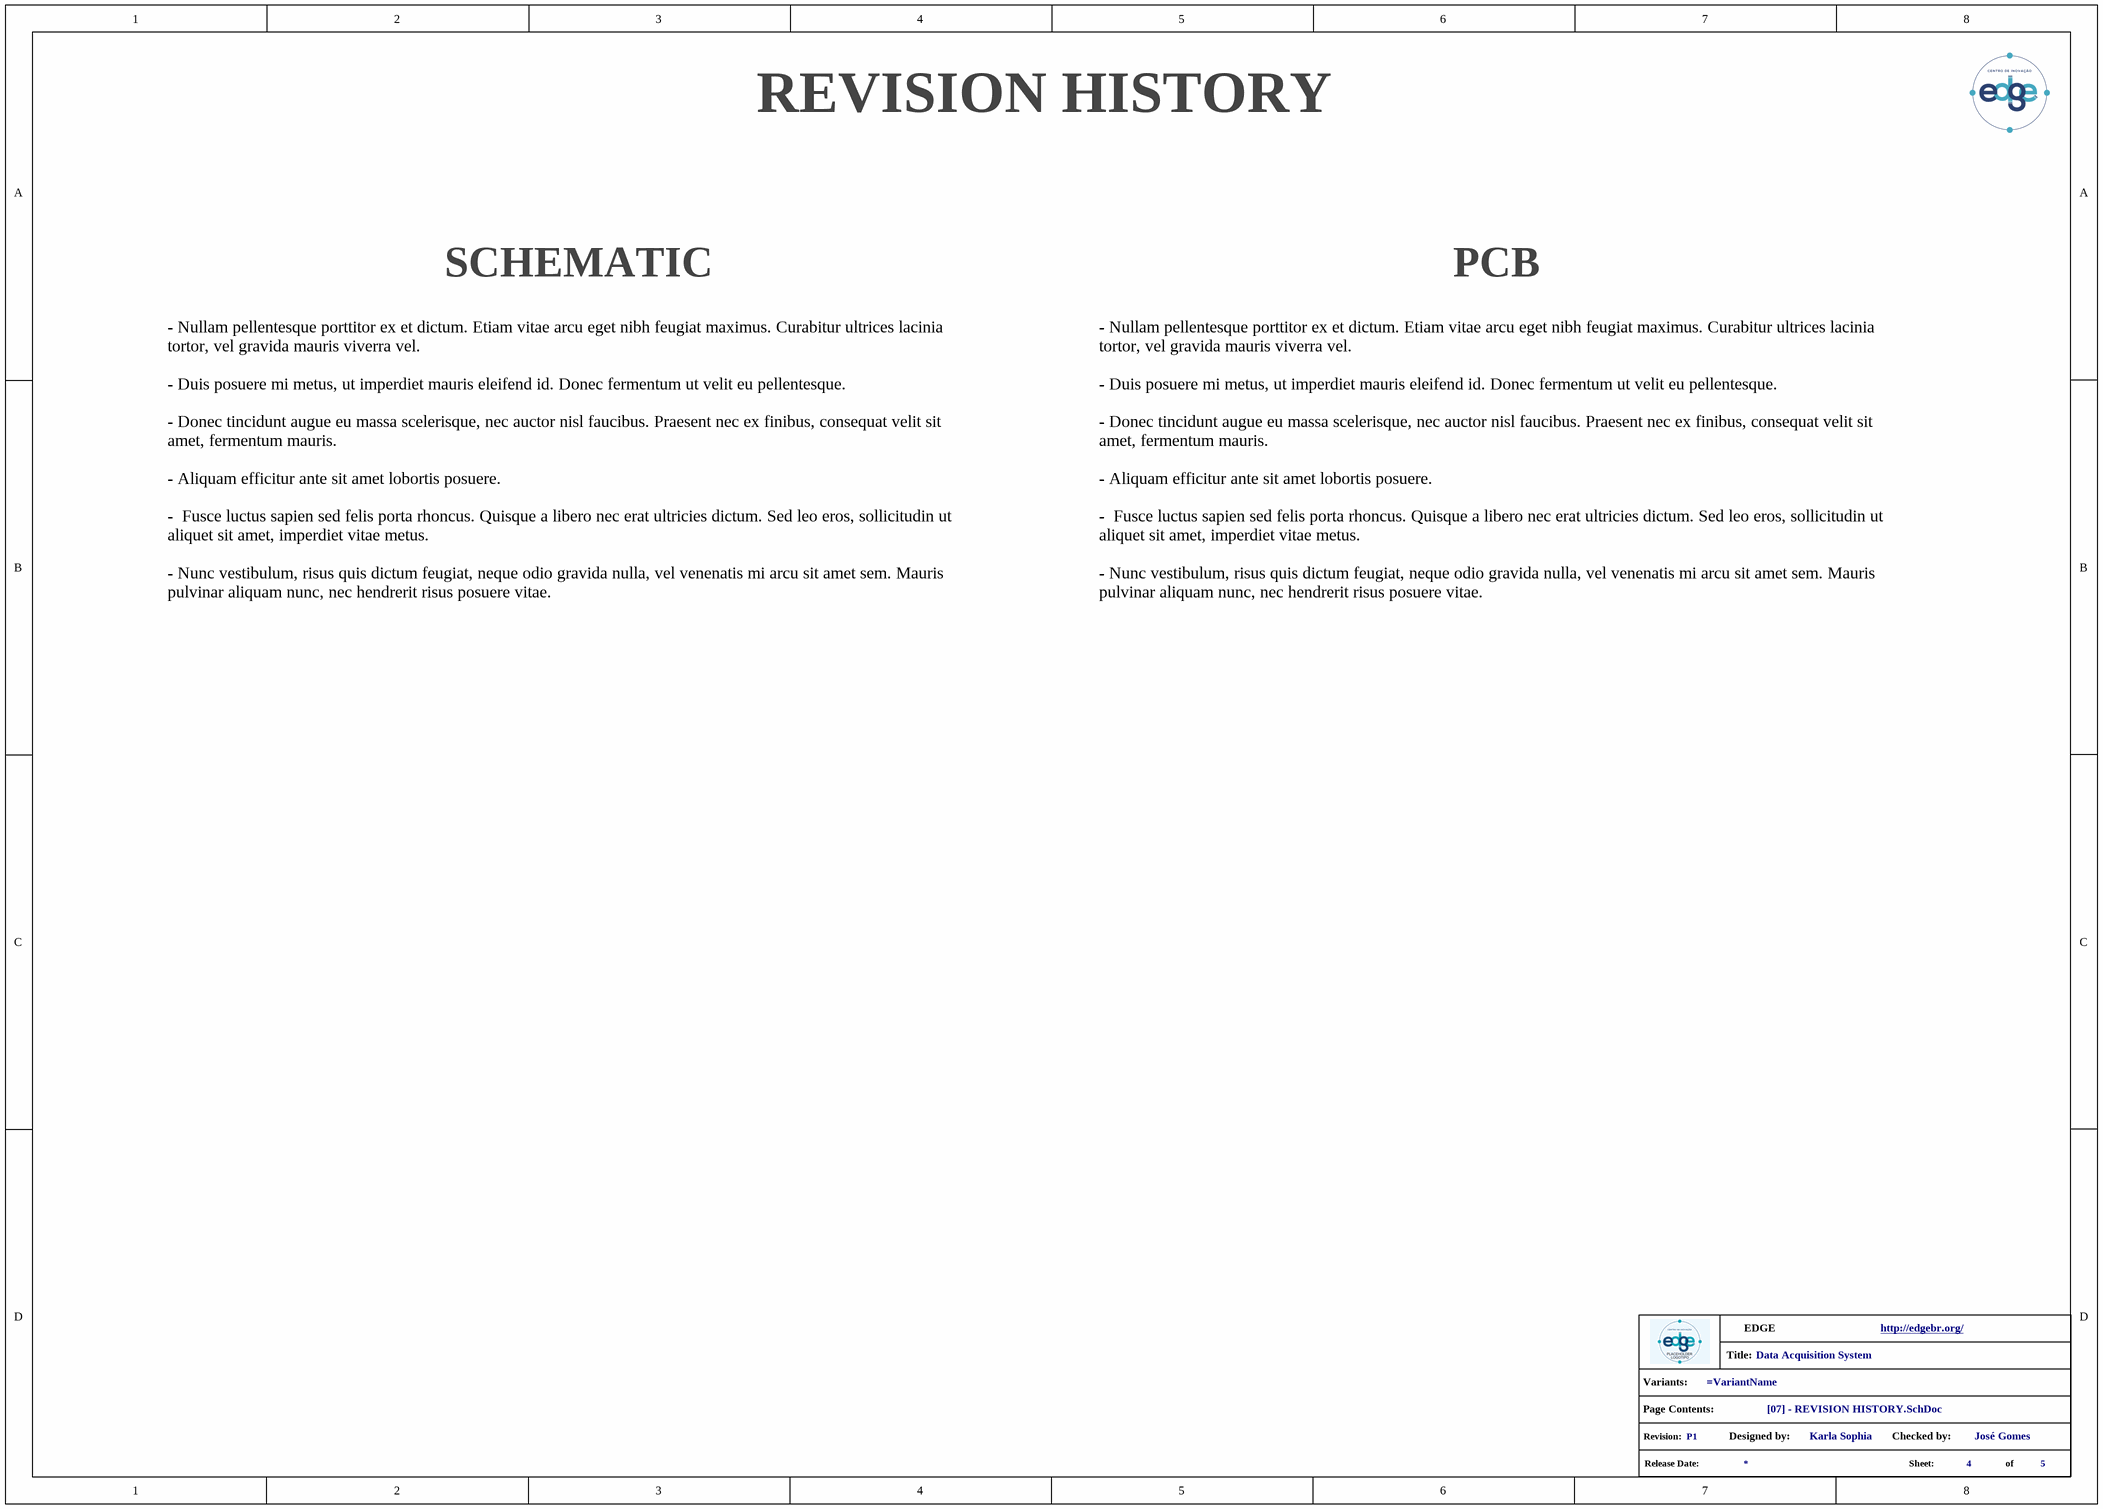
[diagram p7: [07] - REVISION HISTORY.SchDoc]

### Parts
*  info_project  (value not drawn)  (graphical)

### Notes on the sheet
- REVISION HISTORY
- SCHEMATIC
- PCB
- - Nullam pellentesque porttitor ex et dictum. Etiam vitae arcu eget nibh feugiat maximus. Curabitur ultrices lacinia tortor, vel gravida mauris viverra vel.
  - Duis posuere mi metus, ut imperdiet mauris eleifend id. Donec fermentum ut velit eu pellentesque.
  - Donec tincidunt augue eu massa scelerisque, nec auctor nisl faucibus. Praesent nec ex finibus, consequat velit sit amet, fermentum mauris.
  - Aliquam efficitur ante sit amet lobortis posuere.
  -  Fusce luctus sapien sed felis porta rhoncus. Quisque a libero nec erat ultricies dictum. Sed leo eros, sollicitudin ut aliquet sit amet, imperdiet vitae metus.
  - Nunc vestibulum, risus quis dictum feugiat, neque odio gravida nulla, vel venenatis mi arcu sit amet sem. Mauris pulvinar aliquam nunc, nec hendrerit risus posuere vitae.
- (in symbol info_project) Title:; Variants:; Page Contents:; Revision:; Designed by:; Checked by:; Release Date:; Sheet:; of

### Library data of the parts
* = info_project: GRAPHICAL - Info Project

## Nets that join several sheets
+3V3: [03] - MCU (16 pins), [06] - PROTOCOLS (10 pins), [04] - POWER SUPPLY (C11.1 R15.1 R17.2 U3.2), [05] - PERIPHERALS (J5.1)
GND: [03] - MCU (15 pins), [06] - PROTOCOLS (31 pins), [04] - POWER SUPPLY (19 pins), [05] - PERIPHERALS (16 pins)
CAN_RX: [03] - MCU (U1.45), [06] - PROTOCOLS (U9.4)
CAN_TX: [03] - MCU (U1.46), [06] - PROTOCOLS (U9.1)
I2C2_SCL: [03] - MCU (R11.1 U1.42), [06] - PROTOCOLS (J7.2)
I2C2_SDA: [03] - MCU (R12.1 U1.43), [06] - PROTOCOLS (J7.1)
I2C2_SMBAI: [03] - MCU (U1.25), [06] - PROTOCOLS (J7.3)
INVALID: [03] - MCU (U1.29), [06] - PROTOCOLS (RS1.10)
NRST_C: [03] - MCU (P1.3 U1.7), [04] - POWER SUPPLY (C12.2 R17.1 SW1.3 SW1.4)
PA5_ADC_IN: [03] - MCU (U1.15), [05] - PERIPHERALS (C13.2 R18.1 R21.2)
PA6_ADC_IN: [03] - MCU (U1.16), [05] - PERIPHERALS (C14.2 R19.1 R22.2)
PA7_ADC_IN: [03] - MCU (U1.17), [05] - PERIPHERALS (C15.2 R20.1 R23.2)
PB0_PWM: [03] - MCU (U1.18), [05] - PERIPHERALS (R24.1)
PB1_PWM: [03] - MCU (U1.19), [05] - PERIPHERALS (R25.1)
PB2_DIR: [03] - MCU (U1.20), [06] - PROTOCOLS (R34.2 RS2.2 RS2.3)
PB13_INPUT: [03] - MCU (U1.26), [05] - PERIPHERALS (J4.1)
PB14_INPUT: [03] - MCU (U1.27), [05] - PERIPHERALS (J4.2)
PB15_OUTPUT: [03] - MCU (U1.28), [05] - PERIPHERALS (D1.2)
PC13_OUTPUT: [03] - MCU (U1.2), [05] - PERIPHERALS (D2.2)
PC14_INPUT: [03] - MCU (U1.3), [05] - PERIPHERALS (J4.3)
PC15_OUTPUT: [03] - MCU (U1.4), [05] - PERIPHERALS (D3.2)
SPI_MISO: [03] - MCU (U1.40), [06] - PROTOCOLS (J8.3)
SPI_MOSI: [03] - MCU (U1.41), [06] - PROTOCOLS (J8.5)
SPI_NSS: [03] - MCU (U1.38), [06] - PROTOCOLS (J8.4)
SPI_SCK: [03] - MCU (U1.39), [06] - PROTOCOLS (J8.2)
UART_232_RX: [03] - MCU (R7.2), [06] - PROTOCOLS (RS1.9)
UART_232_TX: [03] - MCU (R8.2), [06] - PROTOCOLS (RS1.11)
UART_485_RX: [03] - MCU (R9.1), [06] - PROTOCOLS (R31.1 RS2.1)
UART_485_TX: [03] - MCU (R10.1), [06] - PROTOCOLS (RS2.4)
USART_CK: [03] - MCU (R6.1), [06] - PROTOCOLS (J10.5)
USART_CTS: [03] - MCU (R2.1), [06] - PROTOCOLS (J10.4)
USART_RTS: [03] - MCU (R5.1), [06] - PROTOCOLS (J10.3)
USART_RX: [03] - MCU (R4.1), [06] - PROTOCOLS (J10.1)
USART_TX: [03] - MCU (R3.1), [06] - PROTOCOLS (J10.2)
USB_D_N: [03] - MCU (U1.32), [04] - POWER SUPPLY (J1.2 U2.1)
USB_D_P: [03] - MCU (R13.2 U1.33), [04] - POWER SUPPLY (J1.3 U2.3)